# Altium schematic sheet 6_FE-MISC.schdoc
size 210 x 148 mm; Symbol: tv_muban1_1; Company: 嘉立创EDA; Version: V1.0; Page Size: A4; @Project Name: LCEDAsucaiku; @Update Date: 2026-05-01; @Create Date: 2026-03-27; @Page Name: FE-MISC; @Page Count: 8; @Page No: 6; @Update Time: 19:01:20; Color: #990000; Device: sucai_muban; @Board Name: tv基板; @Create Time: 22:34:06; @Schematic Name: Schematic1; @Assembly Variant: Basic; Border: 1; Title Block Position: 3; Size: A4; Width: 826; Height: 582; Region Start: 1; X Region Count: 6; Y Region Count: 4; Blade Width: 10; SheetNumber: 6; SheetTotal: 8
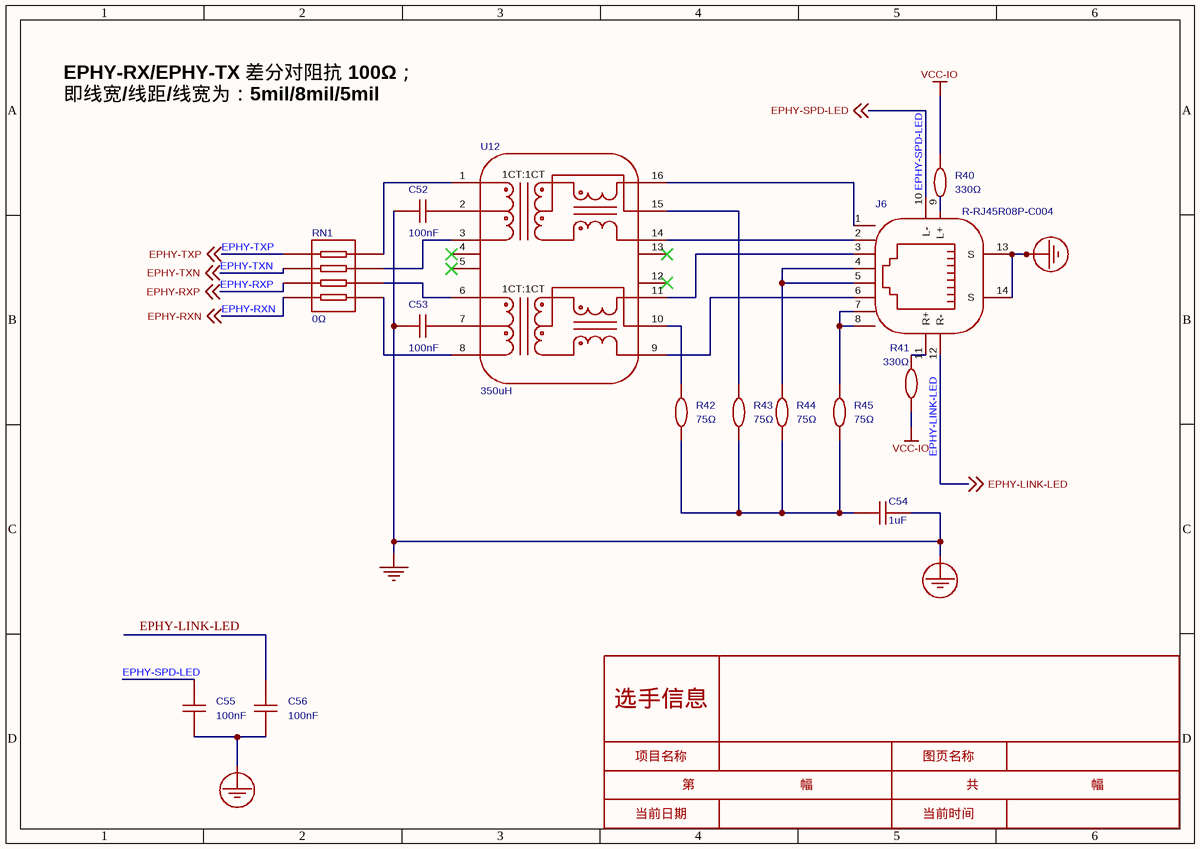
[diagram p0: 6_FE-MISC.schdoc]

## Parts
C52  100nF  [C0402]
C53  100nF  [C0402]
C54  1uF  [C1206]
C55  100nF  [C0402]
C56  100nF  [C0402]
J6  R-RJ45R08P-C004  [RJ45-TH_R-RJ45R08P-C004]
R40  330Ω  [R0402]
R41  330Ω  [R0402]
R42  75Ω  [R0603]
R43  75Ω  [R0603]
R44  75Ω  [R0603]
R45  75Ω  [R0603]
RN1  0Ω  [RES-ARRAY-SMD_0603-8P-L3.2-W1.6-BL]
U12  350uH  [XFMR-SMD_16P-L12.7-W7.1-P1.27-LS9.4-BL]

## Nets
GND: C52.2 C53.2 C54.2 C55.1 C56.1 J6.13(S) J6.14(S)  [also labelled PGND]
VCC-IO: R40.1 R41.1
EPHY-LINK-LED: C56.2 J6.12(R-) ; off-sheet EPHY-LINK-LED
EPHY-RXN: RN1.4 ; off-sheet EPHY-RXN
EPHY-RXP: RN1.3 ; off-sheet EPHY-RXP
EPHY-SPD-LED: C55.2 J6.10(L-) ; off-sheet EPHY-SPD-LED
EPHY-TXN: RN1.2 ; off-sheet EPHY-TXN
EPHY-TXP: RN1.1 ; off-sheet EPHY-TXP
NetC52_1: C52.1 U12.2
NetC53_1: C53.1 U12.7
NetC54_1: C54.1 R42.1 R43.1 R44.1 R45.1
NetJ6_1: J6.1 U12.16
NetJ6_2: J6.2 U12.14
NetJ6_3: J6.3 U12.11
NetJ6_4: J6.4 J6.5 R44.2
NetJ6_6: J6.6 U12.9
NetJ6_7: J6.7 J6.8 R45.2
NetJ6_9: J6.9(L+) R40.2
NetJ6_11: J6.11(R+) R41.2
NetR42_2: R42.2 U12.10
NetR43_2: R43.2 U12.15
NetRN1_5: RN1.5 U12.8
NetRN1_6: RN1.6 U12.6
NetRN1_7: RN1.7 U12.3
NetRN1_8: RN1.8 U12.1

Not connected (* = marked no-connect by the designer): U12 4* 5* 12* 13*

## Notes on the sheet
- EPHY-RX/EPHY-TX 差分对阻抗 100Ω；
  即线宽/线距/线宽为：5mil/8mil/5mil
- 选手信息
- 项目名称
- 第                              幅
- 图页名称
- 共                                幅
- 当前日期
- 当前时间

## Library data of the parts
C52 C53 C55 C56 = CL05B104KO5NNNC: 容值:100nF;精度:±10%;额定电压:16V;温度系数:X7R;; Manufacturer: SAMSUNG(三星); 3D Model: 36a51122f27c49738f86b3bfa98863e0聨0819f05c4eef4c71ace90d822a990e87; 3D Model Transform: 39.37,19.685,0,0,0,0,0,0,0; Tolerance: ±10%; Voltage Rating: 16V; Temperature Coefficient: X7R; AddInBom: yes; ModelName: C0402_L1.0-W0.5-H0.5; Symbol: CL05B104KO5NNNC; Device: CL05B104KO5NNNC; LCSC Part Name: 100nF ±10% 16V; Supplier Part: C1525; Manufacturer Part: CL05B104KO5NNNC; Supplier Footprint: 0402; JLCPCB Part Class: Basic Part; Datasheet: https://item.szlcsc.com/datasheet/CL05B104KO5NNNC/1877.html; Supplier: LCSC; Value: 100nF; ConvertToPcb: yes; FootprintName: C0402
C54 = CL31B105KBHNNNE: 容值:1uF;精度:±10%;额定电压:50V;温度系数:X7R;; Manufacturer: SAMSUNG(三星); AddInBom: yes; ModelId: e4be705b945545a48e666415e3682bd8聨0819f05c4eef4c71ace90d822a990e87; ModelName: C1206_L3.2-W1.6-H1.3; ModelTransform: 125.984,62.992,0,0,0,0,0,0,0; Tolerance: ±10%; Voltage Rating: 50V; Temperature Coefficient: X7R; Symbol: CL31B105KBHNNNE; Device: CL31B105KBHNNNE; LCSC Part Name: 1uF ±10% 50V; SupplierPart: C1848; ManufacturerPart: CL31B105KBHNNNE; Supplier Footprint: 1206; JLCPCB Part Class: Basic Part; Datasheet: https://item.szlcsc.com/datasheet/CL31B105KBHNNNE/2200.html; Supplier: LCSC; ConvertToPcb: yes; FootprintName: C1206; Value: 1uF
J6 = R-RJ45R08P-C004: 连接器类型:RJ45插座;安装方式:弯插;端口数量:1;LED:带LED;屏蔽:有屏蔽;等级:-;触头材质:磷青铜;触头镀层:金;工作温度:0℃~+70℃;; Manufacturer: Ckmtw(灿科盟); AddInBom: yes; ModelId: 7d68f79fef814152a52c058157038b8b聨0819f05c4eef4c71ace90d822a990e87; ModelName: RJ45-TH_L16.3-W15.8-H13.1; ModelTransform: 647.6365,631.889,0,0,0,0,0,-129.921,-137.795; Connector Type: RJ45插座; Number of Ports: 1; LED: 带LED; Shielding: 有屏蔽; Supplementary Features: 有弹片; Symbol: R-RJ45R08P-C004; Device: R-RJ45R08P-C004; LCSC Part Name: 弯插 带LED; SupplierPart: C386759; ManufacturerPart: R-RJ45R08P-C004; Supplier Footprint: 弯插; JLCPCB Part Class: Extended Part; Datasheet: https://item.szlcsc.com/datasheet/R-RJ45R08P-C004/360866.html; Supplier: LCSC; ConvertToPcb: yes; FootprintName: RJ45-TH_R-RJ45R08P-C004; Mounting Type: 弯插; Ratings: -; Contact Material: 磷青铜; Contact Plating: 金; Operating Temperature: 0℃~+70℃
R40 R41 = 0402WGF3300TCE: 电阻类型:厚膜电阻;阻值:330Ω;精度:±1%;功率:62.5mW;工作电压:50V;温度系数:±100ppm/℃;; Manufacturer: UNI-ROYAL(厚声); 3D Model: 98c88bc2b9094f218f3a3e30a7012738聨0819f05c4eef4c71ace90d822a990e87; 3D Model Transform: 39.37,19.685,0,0,0,0,0,0,0; Tolerance: ±1%; Power(Watts): 62.5mW; Voltage-Supply(Max): 50V; AddInBom: yes; ModelName: R0402_L1.0-W0.5-H0.4; Symbol: 0402WGF3300TCE; Device: 0402WGF3300TCE; LCSC Part Name: 330Ω ±1% 62.5mW 厚膜电阻; Supplier Part: C25104; Manufacturer Part: 0402WGF3300TCE; Supplier Footprint: 0402; JLCPCB Part Class: Basic Part; Datasheet: https://item.szlcsc.com/datasheet/0402WGF3300TCE/25847.html; Supplier: LCSC; Type: 厚膜电阻; Value: 330Ω; Temperature Coefficient: ±100ppm/℃; Operating Temperature: -55℃~+155℃; ConvertToPcb: yes; FootprintName: R0402
R42-R45 = 0603WAF750JT5E: 电阻类型:厚膜电阻;阻值:75Ω;精度:±1%;功率:100mW;工作电压:75V;温度系数:±100ppm/℃;; Manufacturer: UNI-ROYAL(厚声); AddInBom: yes; ModelId: fc143cca1e79419f9cd78b61e9279f08聨0819f05c4eef4c71ace90d822a990e87; ModelTransform: 31.8897,63.7794,0,90,0,0,0,0,0; Tolerance: ±1%; Power(Watts): 100mW; Voltage-Supply(Max): 75V; Symbol: 0603WAF750JT5E; Device: 0603WAF750JT5E; LCSC Part Name: 75Ω ±1% 100mW 厚膜电阻; SupplierPart: C4275; ManufacturerPart: 0603WAF750JT5E; Supplier Footprint: 0603; JLCPCB Part Class: Basic Part; Datasheet: https://item.szlcsc.com/datasheet/0603WAF750JT5E/4682.html; Supplier: LCSC; ConvertToPcb: yes; FootprintName: R0603; ModelName: R0603; Type: 厚膜电阻; Value: 75Ω; Temperature Coefficient: ±100ppm/℃; Operating Temperature: -55℃~+155℃
RN1 = 4D03WGJ0000T5E: 电阻器数:4;阻值:0Ω;精度:±5%;单个元件功率:62.5mW;温度系数:±400ppm/℃;; Manufacturer: UNI-ROYAL(厚声); AddInBom: yes; ModelId: edf39f9a2dca4b9a94267f442dd4f95a聨0819f05c4eef4c71ace90d822a990e87; ModelName: R0603-8P_L3.2-W1.6-H0.6; ModelTransform: 125.984,62.992,0,0,0,0,0,0,0; Number of Resistors: 4; Tolerance: ±5%; Power(Watts): 62.5mW; Symbol: 4D03WGJ0000T5E; Device: 4D03WGJ0000T5E; LCSC Part Name: 0Ω ±5%; SupplierPart: C1952; ManufacturerPart: 4D03WGJ0000T5E; Supplier Footprint: 0603x4; JLCPCB Part Class: Extended Part; Datasheet: https://item.szlcsc.com/datasheet/4D03WGJ0000T5E/2304.html; Supplier: LCSC; ConvertToPcb: yes; FootprintName: RES-ARRAY-SMD_0603-8P-L3.2-W1.6-BL; Value: 0Ω; Temperature Coefficient: ±400ppm/℃; Number of Pins: 8
U12 = PM44-11BP T-CND: 匝数比:1CT:1CT;速率:10/100M;功能(POE或非POE):POE;; Manufacturer: CND-tek(磁联达); 3D Model: b41a16acba62412c8212b7f795f1fce3聨0819f05c4eef4c71ace90d822a990e87; 3D Model Transform: 499.999,370.078,0,0,0,0,0,0,0; Function: POE; Isolation Voltage(Vrms): 1.5kV; AddInBom: yes; Symbol: PM44-11BP T; Device: PM44-11BP T-CND; LCSC Part Name: 10/100M单端口变压器模块; Supplier Part: C49023303; Manufacturer Part: PM44-11BP T-CND; Supplier Footprint: SMD-16P,12.7x7mm; JLCPCB Part Class: Extended Part; Datasheet: https://item.szlcsc.com/datasheet/PM44-11BP%2520T-CND/51383028.html; Supplier: LCSC; Turns Ratio: 1CT:1CT; rate: 10/100M; Value: 350uH; operating temperature: 0℃~+70℃; ConvertToPcb: yes; FootprintName: XFMR-SMD_16P-L12.7-W7.1-P1.27-LS9.4-BL; ModelName: XFMR-SMD_16P-L12.7-W7.1-P1.27-LS9.4-BL